# Altium schematic sheet TPS40304DRCR.schdoc
size 59 x 40 mm
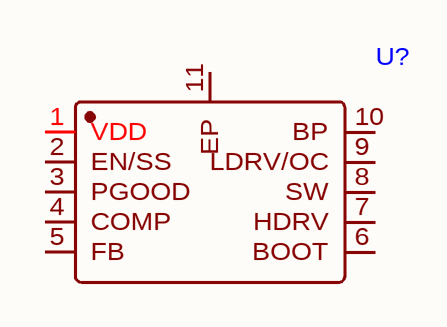
[diagram p0: TPS40304DRCR.schdoc]

## Parts
U?  (no value)  [WSON-10_L3.0-W3.0-P0.50-TL-EP]

## Nets

Not connected (* = marked no-connect by the designer): U? 1(VDD) 2(EN/SS) 3(PGOOD) 4(COMP) 5(FB) 6(BOOT) 7(HDRV) 8(SW) 9(LDRV/OC) 10(BP) 11(EP)

## Library data of the parts
U? = TPS40304DRCR